# Altium schematic sheet Sheet4.SchDoc
size 420 x 297 mm; DocumentNumber: ЭАЕСН.464512.003Э3; SheetNumber: 4; SheetTotal: x; DocumentName: Sheet1.SCHDOC
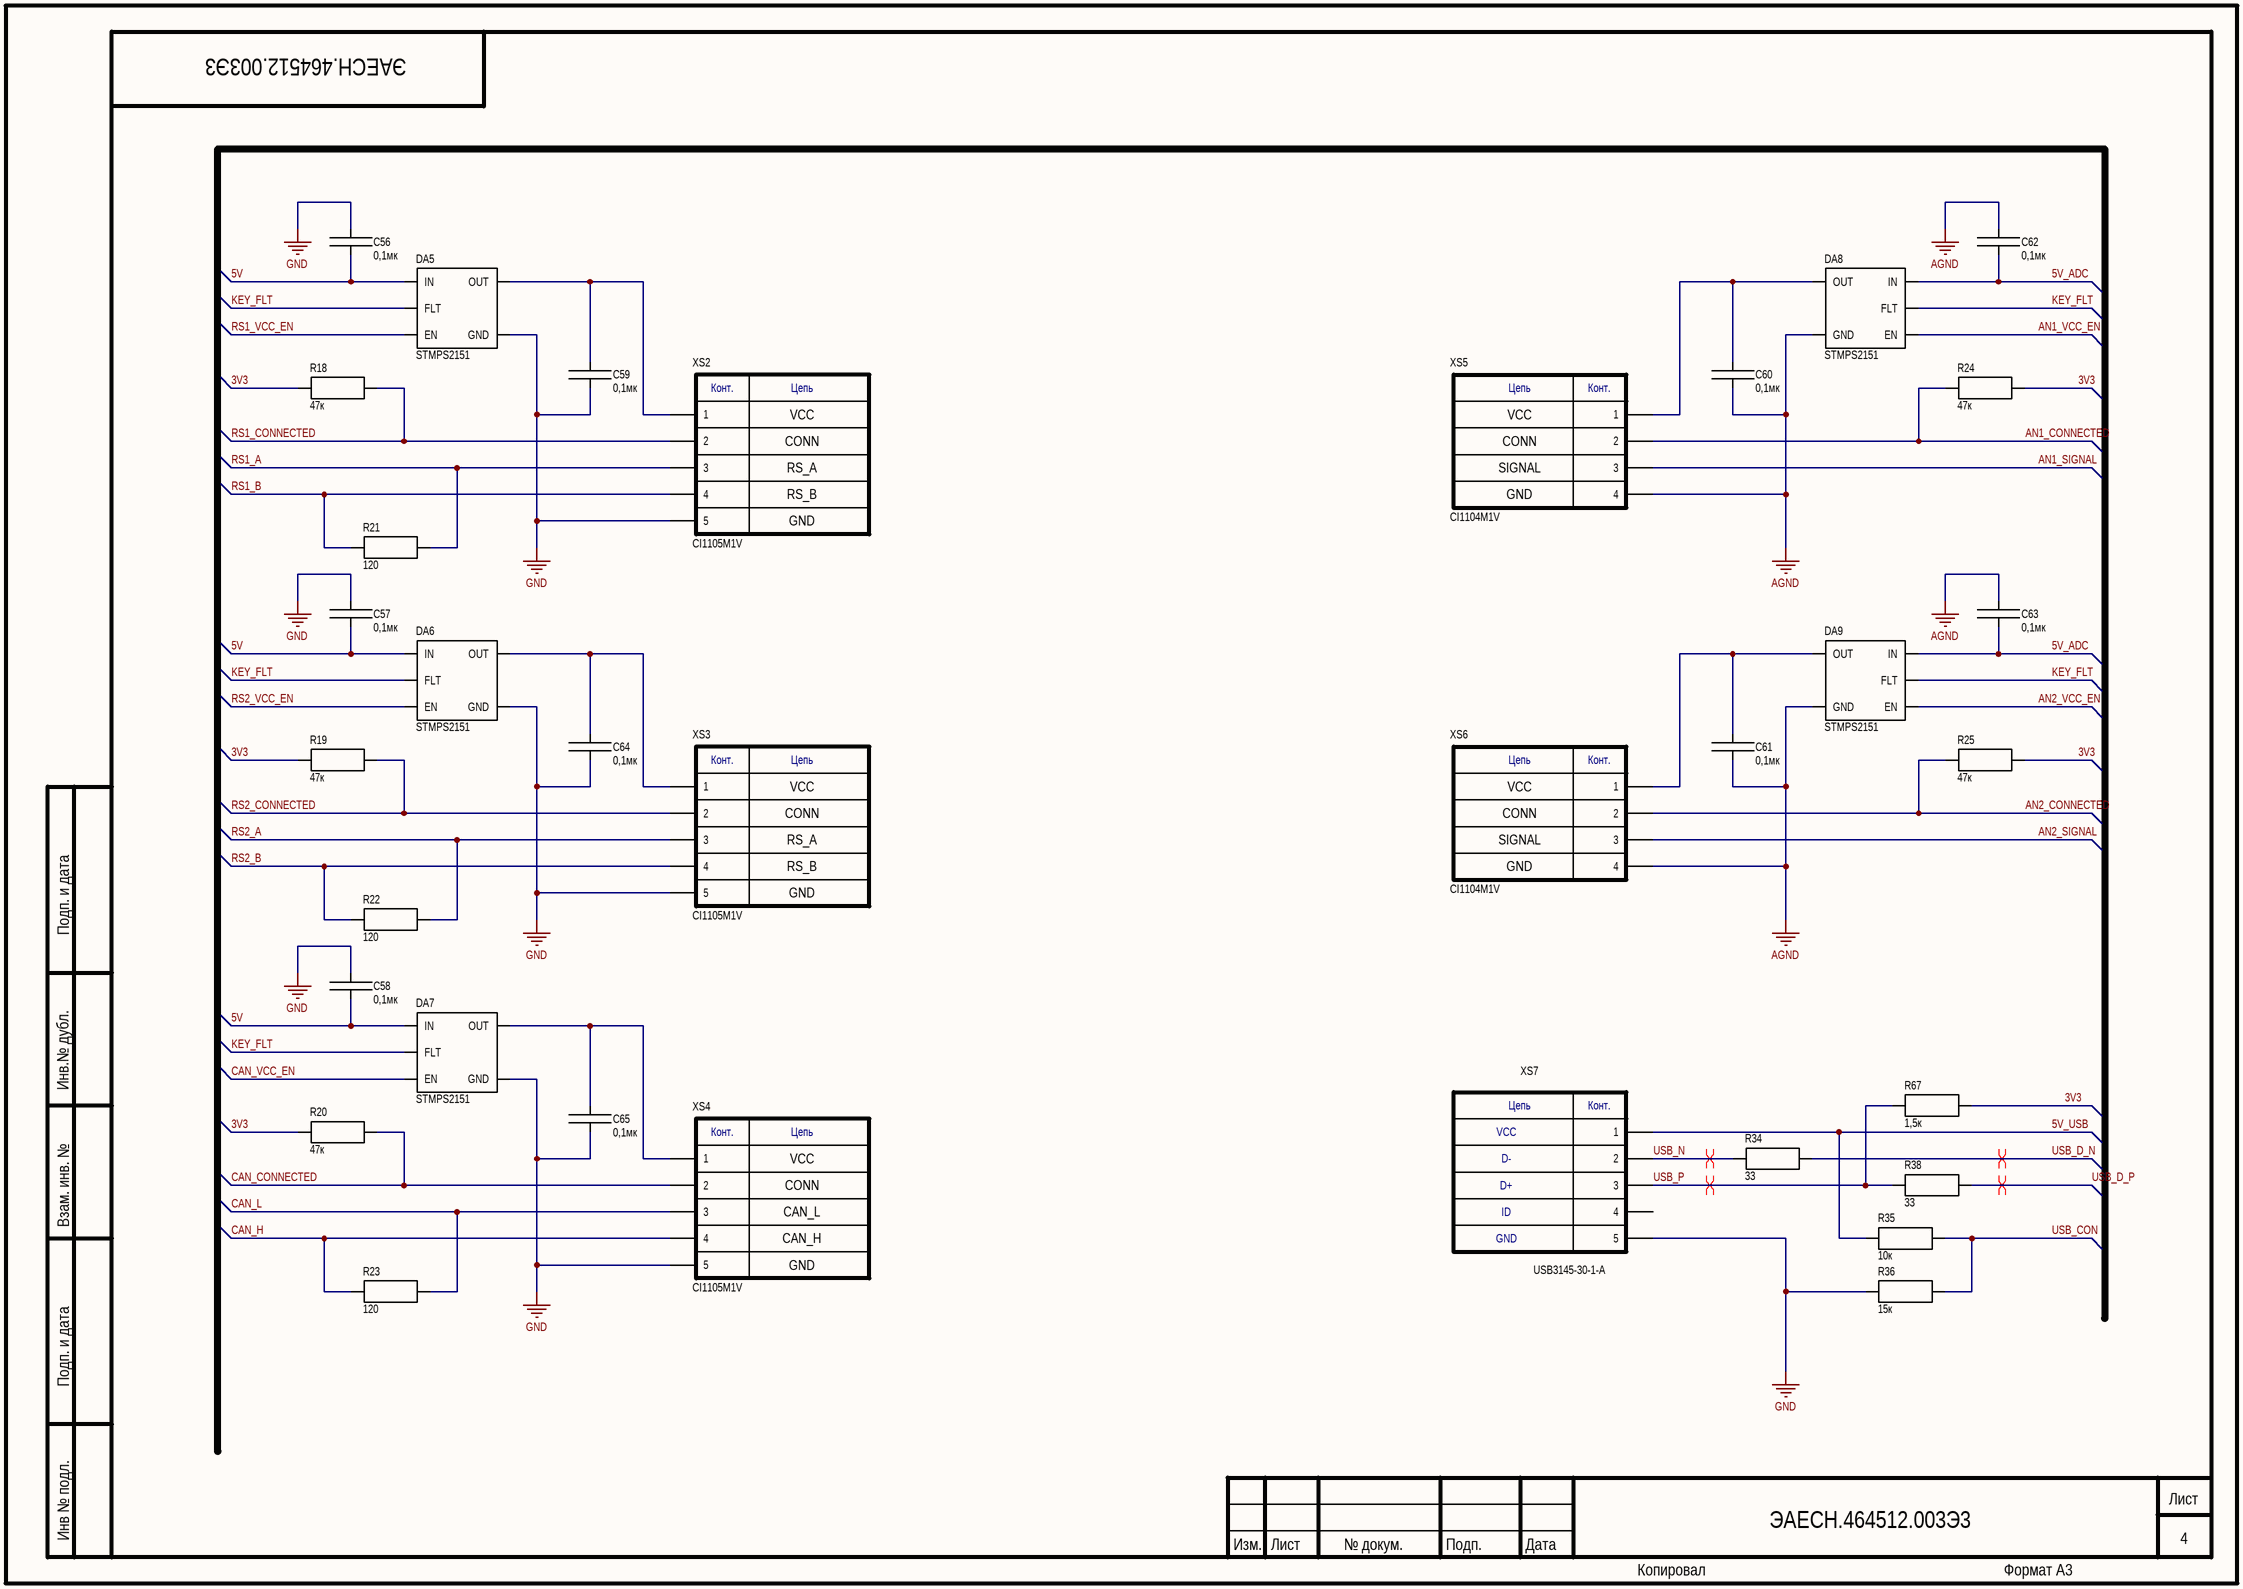
[diagram p0: Sheet4.SchDoc]

## Parts
C56  value 0,1мк  [С0603]  (hidden comment: C)
C57  value 0,1мк  [С0603]  (hidden comment: C)
C58  value 0,1мк  [С0603]  (hidden comment: C)
C59  value 0,1мк  [С0603]  (hidden comment: C)
C60  value 0,1мк  [С0603]  (hidden comment: C)
C61  value 0,1мк  [С0603]  (hidden comment: C)
C62  value 0,1мк  [С0603]  (hidden comment: C)
C63  value 0,1мк  [С0603]  (hidden comment: C)
C64  value 0,1мк  [С0603]  (hidden comment: C)
C65  value 0,1мк  [С0603]  (hidden comment: C)
DA5  STMPS2151  [SOT-23-5]
DA6  STMPS2151  [SOT-23-5]
DA7  STMPS2151  [SOT-23-5]
DA8  STMPS2151  [SOT-23-5]
DA9  STMPS2151  [SOT-23-5]
R18  value 47к  [R0603]  (hidden comment: R)
R19  value 47к  [R0603]  (hidden comment: R)
R20  value 47к  [R0603]  (hidden comment: R)
R21  value 120  [R1206]  (hidden comment: R)
R22  value 120  [R1206]  (hidden comment: R)
R23  value 120  [R1206]  (hidden comment: R)
R24  value 47к  [R0603]  (hidden comment: R)
R25  value 47к  [R0603]  (hidden comment: R)
R34  value 33  [R0603]  (hidden comment: R)
R35  value 10к  [R0603]  (hidden comment: R)
R36  value 15к  [R0603]  (hidden comment: R)
R38  value 33  [R0603]  (hidden comment: R)
R67  value 1,5к  [R0603]  (hidden comment: R)
XS2  CI1105M1V  [СI1105М1V]
XS3  CI1105M1V  [СI1105М1V]
XS4  CI1105M1V  [СI1105М1V]
XS5  СI1104М1V  [СI1104М1V]
XS6  СI1104М1V  [СI1104М1V]
XS7  USB3145-30-1-A  [USB3145-30-1]

## Nets
AGND: C60.2 C61.2 C62.1 C63.1 DA8.2(GND) DA9.2(GND) XS5.4 XS6.4
GND: C56.1 C57.1 C58.1 C59.2 C64.2 C65.2 DA5.2(GND) DA6.2(GND) DA7.2(GND) R36.1 XS2.5 XS3.5 XS4.5 XS7.5
3V3: R18.1 R19.1 R20.1 R24.1 R25.1 R67.2
5V: C56.2 C57.2 C58.2 DA5.5(IN) DA6.5(IN) DA7.5(IN)
5V_ADC: C62.2 C63.2 DA8.5(IN) DA9.5(IN)
5V_USB: R35.1 XS7.1
AN1_CONNECTED: R24.2 XS5.2
AN1_SIGNAL: XS5.3
AN1_VCC_EN: DA8.4(EN)
AN2_CONNECTED: R25.2 XS6.2
AN2_SIGNAL: XS6.3
AN2_VCC_EN: DA9.4(EN)
CAN_CONNECTED: R20.2 XS4.2
CAN_H: R23.1 XS4.4
CAN_L: R23.2 XS4.3
CAN_VCC_EN: DA7.4(EN)
KEY_FLT: DA5.3(FLT) DA6.3(FLT) DA7.3(FLT) DA8.3(FLT) DA9.3(FLT)
RS1_A: R21.2 XS2.3
RS1_B: R21.1 XS2.4
RS1_CONNECTED: R18.2 XS2.2
RS1_VCC_EN: DA5.4(EN)
RS2_A: R22.2 XS3.3
RS2_B: R22.1 XS3.4
RS2_CONNECTED: R19.2 XS3.2
RS2_VCC_EN: DA6.4(EN)
USB_CON: R35.2 R36.2
USB_D_N: R34.2
USB_D_P: R38.2
USB_N: R34.1 XS7.2
USB_P: R38.1 R67.1 XS7.3
NetC59_1: C59.1 DA5.1(OUT) XS2.1
NetC60_1: C60.1 DA8.1(OUT) XS5.1
NetC61_1: C61.1 DA9.1(OUT) XS6.1
NetC64_1: C64.1 DA6.1(OUT) XS3.1
NetC65_1: C65.1 DA7.1(OUT) XS4.1

Not connected (* = marked no-connect by the designer): XS7 4

## Layout directives
differential pair: USB_D_N, USB_D_P, USB_N, USB_P

## Notes on the sheet
- VCC
- CONN
- RS_A
- SIGNAL
- RS_B
- GND
- CAN_L
- CAN_H
- Подп. и дата
- Инв.№ дубл.
- Взам. инв. №
- Инв № подл.
- Изм.
- Лист
- № докум.
- Подп.
- Дата
- Копировал
- Формат А3
- (in symbol 4pin) Цепь; Конт.
- (in symbol 5pin) Конт.; Цепь
- (in symbol USB) Цепь; Конт.; VCC; D-; D+; ID; GND

## Library data of the parts
DA5-DA9 = STMPS21x1
XS2-XS4 = 5pin
XS5 XS6 = 4pin
XS7 = USB